# EAGLE design LaserDriver (EAGLE 6.5.0)
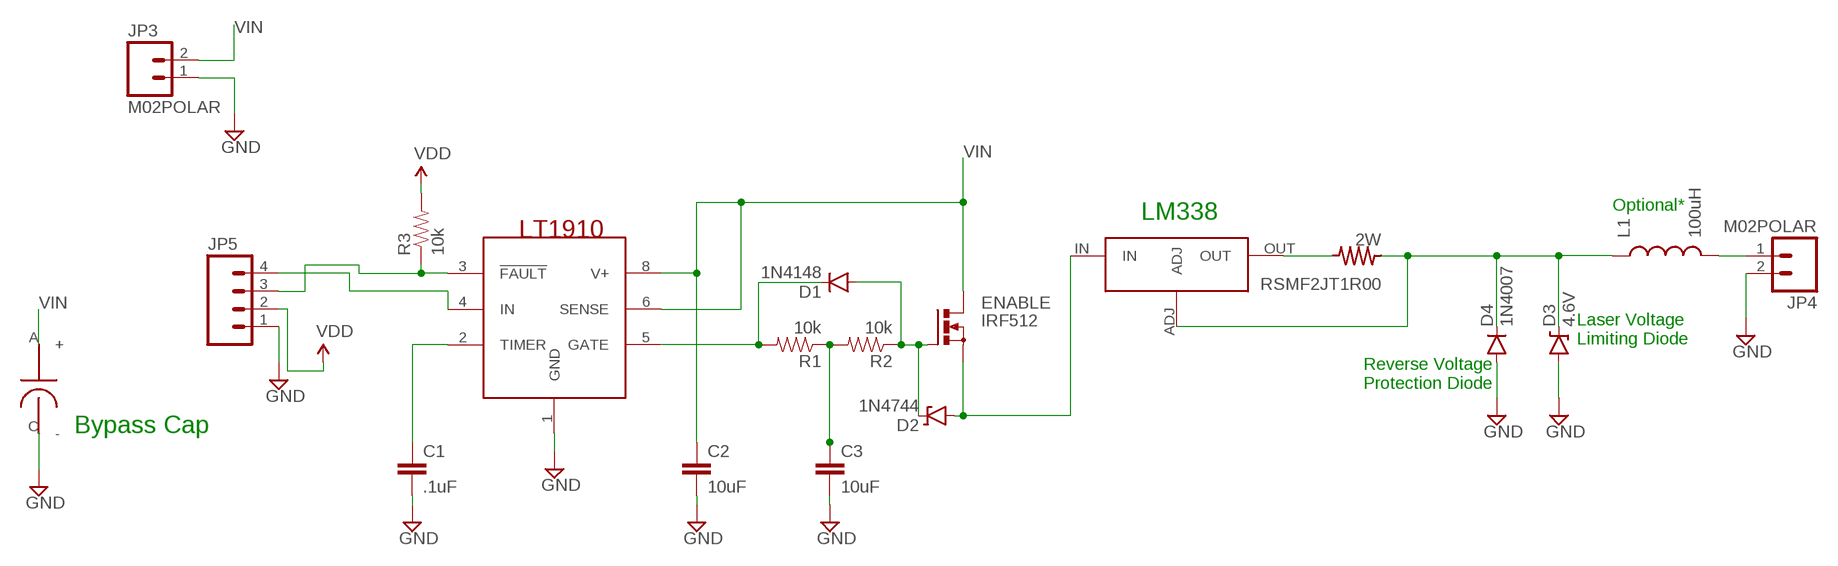
[diagram p0: schematic, sheet 1]

## Parts
BYPASS_CAP  CAP_22UF_1411  [1411]
C1  .1uF  10UF-6.3V-20%(1206)  [1206]
C2  10uF  10UF-6.3V-20%(1206)  [1206]
C3  10uF  10UF-6.3V-20%(1206)  [1206]
D1  1N4148  DIODE1N4148  [DIODE-1N4148]
D2  1N4744  DIODE-ZENERPTH  [DIODE-ZENER]
D3  4.6V  DIODE-ZENERPTH  [DIODE-ZENER]
D4  1N4007  DIODE  [DIODE-1N4001-KIT]
ENABLE  IRF512  [TO220BV]
JP3  M02POLAR  [MOLEX-1X2]
JP4  M02POLAR  [MOLEX-1X2]
JP5  M04SMD  [1X04-SMD]
L1  100uH  INDUCTORAXIAL-0.6  [AXIAL-0.6]
R1  10k  RESISTOR1206  [1206]
R2  10k  RESISTOR1206  [1206]
R3  10k  RESISTOR1206  [1206]
RSMF2JT1R00  2W  PWR_RESISTOR  [2512]
U$1  LT1910  [SO08]
U$2  LM138  [TO220-IGO]

## Nets
GND: BYPASS_CAP.C(-) C1.2 C2.2 C3.2 D3.P$2(A) D4.A JP3.1 JP4.2 JP5.1 U$1.1(GND)
N$1: JP4.1 L1.P$2
N$2: JP5.3 R3.1 U$1.3(!FAULT!)
N$3: C1.1 U$1.2(TIMER)
N$4: D2.P$2(A) ENABLE.S U$2.IN
N$5: C3.1 R1.1 R2.2
N$6: D1.A D2.P$1(C) ENABLE.G R2.1
N$7: RSMF2JT1R00.P$2 U$2.OUT
N$9: JP5.4 U$1.4(IN)
N$10: D1.C R1.2 U$1.5(GATE)
N$11: D3.P$1(C) D4.C L1.P$1 RSMF2JT1R00.P$1 U$2.ADJ
VDD: JP5.2 R3.2
VIN: BYPASS_CAP.A(+) C2.1 ENABLE.D JP3.2 U$1.6(SENSE) U$1.8(V+)

## Notes on the sheet
- Optional*
- LM338
- Laser Voltage
  Limiting Diode
- Reverse Voltage
  Protection Diode
- Bypass Cap

## Library data of the parts
BYPASS_CAP = hmcfabstudio:CAP_22UF_1411
C1 = SparkFun-Capacitors:10UF-6.3V-20%(1206): Ceramic CAP-10057; PROD_ID: CAP-10057; VALUE: 10uF
C2 C3 = SparkFun-Capacitors:10UF-6.3V-20%(1206): Ceramic CAP-10057; PROD_ID: CAP-10057
D1 D4 = SparkFun-DiscreteSemi:DIODE: Diode These are standard reverse protection diodes and small signal diodes. SMA package can handle up to about 1A. SOD-323 can handle about 200mA. What the SOD-323 package when ordering, there are some mfgs out there that are 5-pin packages.
D2 D3 = SparkFun-DiscreteSemi:DIODE-ZENER: Zener Diode Production Part - 8199 3.4V Zener Voltage
ENABLE = transistor-power:IRF512: N-CHANNEL MOS FET
JP3 JP4 = SparkFun-Connectors:M02: Standard 2-pin 0.1" header. Use with - straight break away headers ( PRT-00116) - right angle break away headers (PRT-00553) - swiss pins (PRT-00743) - machine pins (PRT-00117) - female headers (PRT-00115) Molex polarized connector foot print use with: PRT-08233 with associated crimp pins and housings. 2.54_SCREWTERM for use with PRT-10571. 3.5mm Screw Terminal footprints for PRT-08084 5mm Screw Terminal footprints for use with PRT-08433
JP5 = SparkFun-Connectors:M04: Header 4 Standard 4-pin 0.1" header. Use with straight break away headers (SKU : PRT-00116), right angle break away headers (PRT-00553), swiss pins (PRT-00743), machine pins (PRT-00117), and female headers (PRT-00115). Molex polarized connector foot print use with SKU : PRT-08231 with associated crimp pins and housings. 1MM SMD Version SKU: PRT-10208
L1 = SparkFun-Passives:INDUCTOR: Inductors Basic Inductor/Choke - 0603 and 1206. Footprints are not proven and vary greatly between part numbers. SRN6045- 33uH, 20% 1.4A SDR0403-560KL - 56uH, 10%, 500mA RMS/740mA peak
R1-R3 = SparkFun-Passives:RESISTOR: Resistor Basic schematic elements and footprints for 0603, 1206, and PTH resistors.
RSMF2JT1R00 = hmcfabstudio:PWR_RESISTOR
U$1 = hmcfabstudio:LT1910: Digikey: Protected High Side MOSFET Driver
U$2 = hmcfabstudio:LM138

## Board
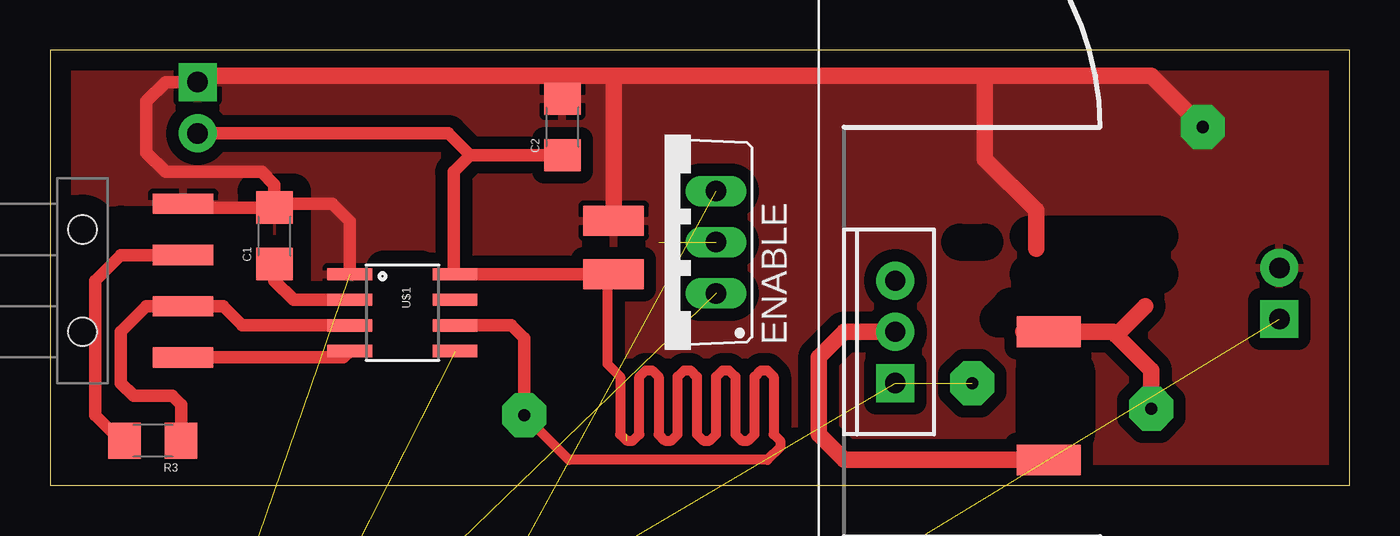
[diagram p1: board, top side]
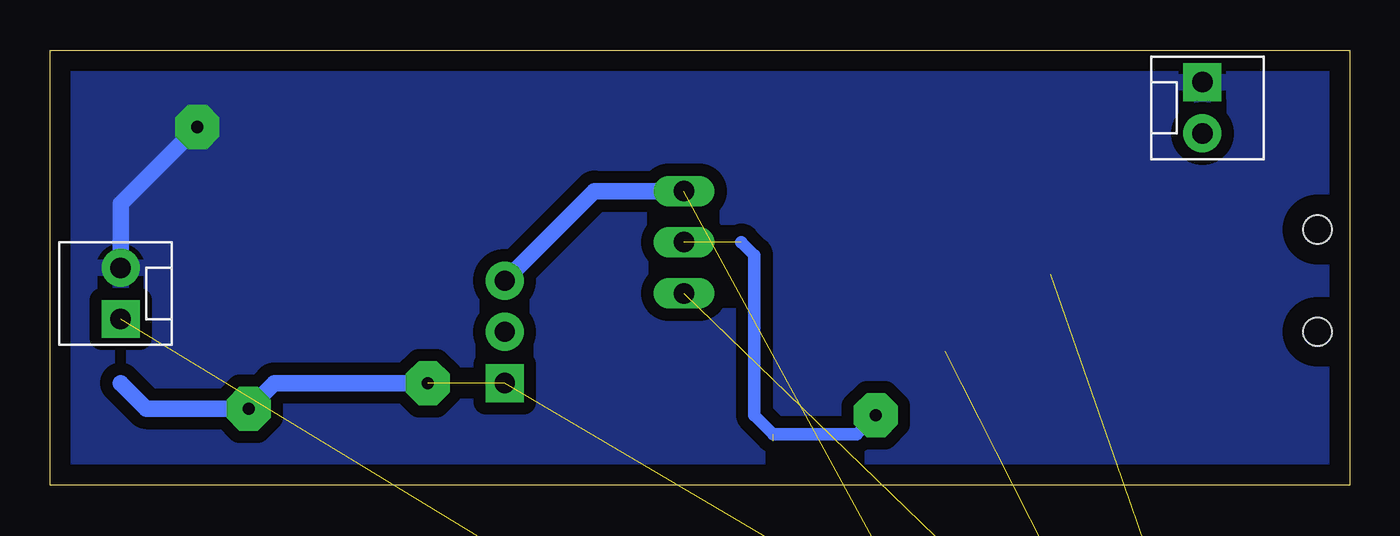
[diagram p2: board, bottom side, seen from below]

Size 64.44 x 21.58 mm. Coordinates in mm from the lower left corner, seen from the top.
Outline: 0,0 64.44,0 64.44,21.58 0,21.58 0,0
Copper layers (1*16): Top 0.035mm / dielectric 1.5mm / Bottom 0.035mm
Design rules "default": minimum track width 10mil, minimum drill 24mil, track to track 8mil, track to pad 8mil, pad to pad 8mil, via to via 8mil, smd to smd 8mil, copper to edge 40mil, drill to drill 8mil, minimum pad ring 10mil, minimum via ring 8mil, stop-mask expansion 4mil, vias tented up to drill 0mil, thermal gap 10mil
tRestrict: 20 lines

### Footprints (pad centres in the part's own frame; a part is rotated, then mirrored left to right if it is on the bottom)
1411 = smd 1.5 x 3: A 0,0; C 2.65,0
1206 = smd 1.6 x 1.8: 1 -1.4,0; 2 1.4,0
DIODE-1N4148 = drill 0.9 pad 1.88: A -3.81,0; C 3.81,0
DIODE-ZENER = drill 0.9: P$1 -3.556,0; P$2 3.556,0
DIODE-1N4001-KIT = drill 1.016 pad 1.88: A -5.08,0; C 5.08,0
TO220BV = drill 1.016 long: D 0,-2.54; G -2.54,-2.54; S 2.54,-2.54
MOLEX-1X2 = drill 1.016 pad 1.88 square: 1 0,0 | drill 1.016 pad 1.88: 2 2.54,0
1X04-SMD = smd 1 x 3: 1 -3.81,5; 2 -1.27,5; 3 1.27,5; 4 3.81,5 | hole 1.4: -2.54,0; 2.54,0
AXIAL-0.6 = drill 1.2 pad 1.88: P$1 -7.62,0; P$2 7.62,0
2512 = smd 1.524 x 3.175: P$1 0,0; P$2 6.35,0
SO08 = smd 0.61 x 2.21: 1 -1.905,-2.616; 2 -0.635,-2.616; 3 0.635,-2.616; 4 1.905,-2.616; 5 1.905,2.616; 6 0.635,2.616; 7 -0.635,2.616; 8 -1.905,2.616
TO220-IGO = drill 1 pad 1.88 square: ADJ -2.54,0 | drill 1 pad 1.88: IN 2.54,0; OUT 0,0

### Placement (x,y rotation side)
BYPASS_CAP  27.94,10.48 90 top
C1  11.11,12.38 90 top
C2  25.4,17.78 90 top
C3  -3.17,-37.15 0 top  (outside the outline)
D1  -0.64,-26.67 0 top  (outside the outline)
D2  -0.95,-41.27 0 top  (outside the outline)
D3  -0.95,-44.13 0 top  (outside the outline)
D4  0.64,-47.62 0 top  (outside the outline)
ENABLE  30.48,12.06 90 top
JP3  7.3,20 270 bottom
JP4  60.96,8.26 90 bottom
JP5  1.59,10.16 270 top
L1  3.17,-22.23 0 top  (outside the outline)
R1  -3.17,-29.53 0 top  (outside the outline)
R2  -3.17,-33.34 0 top  (outside the outline)
R3  5.08,2.22 180 top
RSMF2JT1R00  49.53,7.62 270 top
U$1  17.46,8.57 270 top
U$2  41.91,7.62 90 top

### Tracks (layer width: path | path; a pad name or v marks a point on that pad's centre or on a via)
GND  (via drill 0.6 pad 2.18)  (3 unrouted)
  Top 0.61: C1.2 6.78,13.78 JP5.1 | C1.2 11.11,14.92 10.48,15.56 5.71,15.56 4.76,16.51 4.76,19.05 5.71,20 JP3.1 7.62,20.32 | U$1.1 14.85,13.09 13.97,13.97 11.3,13.97 C1.2 | C2.2 25.4,20.32
  Top 0.813: 27.94,20.32 45.72,20.32 46.35,20.32 | 27.94,20.32 25.4,20.32 7.62,20.32 | 27.51,13.13 BYPASS_CAP.C 27.94,20.32 | 46.35,20.32 54.61,20.32 v57.15,17.78 v57.16,17.77 | 48.9,11.74 48.9,13.65 46.35,16.19 46.35,20.32
  Bottom 0.813: v57.15,17.78 60.96,13.97 JP4.2
  pour Top (isolate 0.61): 64.77,21.59 64.77,0 0,0 0,21.59
  pour Bottom (isolate 0.61): 0,0 0,21.59 64.14,21.59 64.14,0
N$1  (1 unrouted)
N$2
  Top 0.61: U$1.3 9.53,7.94 8.57,8.89 JP5.3 4.76,8.89 3.49,7.62 3.49,5.08 4.13,4.45 6.03,4.45 6.48,4 R3.1
N$3
  Top 0.61: U$1.2 12.06,9.21 11.11,10.16 C1.1
N$4  (1 unrouted)
  Bottom 0.813: U$2.IN 37.47,14.61 ENABLE.S
N$5  (2 unrouted)
N$6  (3 unrouted)
N$7
  Top 0.813: RSMF2JT1R00.P$2 39.37,1.27 38.1,2.54 38.1,6.35 39.37,7.62 U$2.OUT
N$9
  Top 0.61: JP5.4 14.53,6.35 U$1.4
N$10  (2 unrouted)
N$11  (via drill 0.6 pad 2.18)  (4 unrouted)
  Top 0.813: 48.26,7.62 RSMF2JT1R00.P$1 52.7,7.62 52.86,7.46 | 52.86,7.46 54.61,5.71 v54.61,3.81 | 54.3,8.9 52.86,7.46
  Bottom 0.813: 60.96,5.08 59.69,3.81 v54.61,3.81 53.34,5.08 v45.72,5.08
VDD
  Top 0.61: R3.2 3.49,2.22 2.22,3.49 2.22,10.16 3.49,11.43 JP5.2
VIN  (via drill 0.6 pad 2.18)  (2 unrouted)
  Top 0.508: BYPASS_CAP.A 27.62,10.48 27.62,6.03 28.26,5.4 28.26,2.54 28.57,2.22 28.89,2.22 29.21,2.54 29.21,5.4 29.53,5.71 29.84,5.71 30.16,5.4 30.16,2.54 30.48,2.22 30.8,2.22 31.11,2.54 31.11,5.4 31.43,5.71 31.75,5.71 32.07,5.4 32.07,2.54 32.38,2.22 32.7,2.22 33.02,2.54 33.02,5.4 33.34,5.71 33.66,5.71 33.97,5.4 33.97,2.54 34.29,2.22 34.61,2.22 34.92,2.54 34.92,5.4 35.24,5.71 35.56,5.71 35.88,5.4 35.88,2.54 36.2,2.22 36.2,1.91 35.56,1.27 25.72,1.27 23.81,3.17
  Top 0.61: C2.1 20.82,16.38 | 20.82,16.38 20,15.56 20,10.55 U$1.8 BYPASS_CAP.A | JP3.2 19.74,17.46 20.82,16.38 | v23.5,3.49 23.5,7.3 22.86,7.94 U$1.6
  Bottom 0.61: 30.16,12.06 29.53,11.43 29.53,3.49 28.57,2.54 24.45,2.54 v23.5,3.49